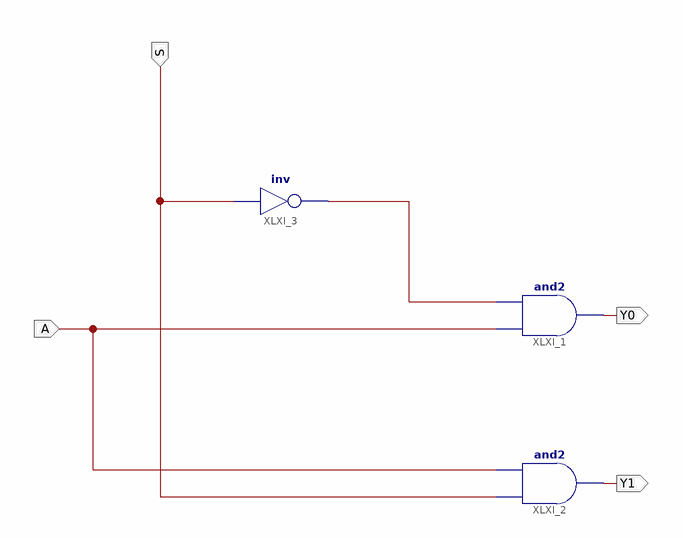
[diagram p0: schematic sheet 1]
// Xilinx ISE schematic demux2to1.sch (spartan3e) as structural Verilog: 3 symbols, 4 ports
module demux2to1 (
  input  S,
  input  A,
  output Y0,
  output Y1
);

  wire XLXN_1;

  and XLXI_1 (Y0, A, XLXN_1);
  and XLXI_2 (Y1, S, A);
  not XLXI_3 (XLXN_1, S);
endmodule
